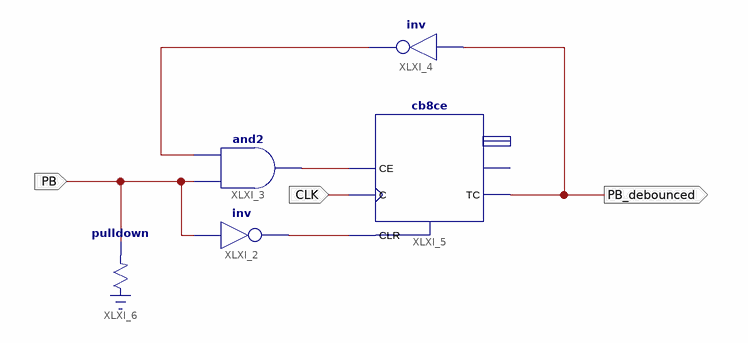
[diagram p0: schematic sheet 1]
// Xilinx ISE schematic debounce.sch (spartan6) as structural Verilog: 5 symbols, 3 ports
module debounce (
  input  CLK,
  input  PB,
  output PB_debounced
);

  wire XLXN_1, XLXN_5, XLXN_9;

  not XLXI_2 (XLXN_1, PB);
  and XLXI_3 (XLXN_5, PB, XLXN_9);
  not XLXI_4 (XLXN_9, PB_debounced);
  cb8ce XLXI_5 (.C(CLK), .CE(XLXN_5), .CLR(XLXN_1), .TC(PB_debounced));  // open: CEO, Q
  \pulldown  XLXI_6 (.O(PB));
endmodule
